# EAGLE design usbspk (EAGLE 6.1)
Test
DOC_ID: CLK-SCH-50; DOC_PART_NO: CLK-PC-03-AUD; DOC_REV: A; DOC_SUBTITLE: EVAL; DOC_TITLE: PCM2704 + TPA2005; PROJECT_NAME: ALARM CLOCK
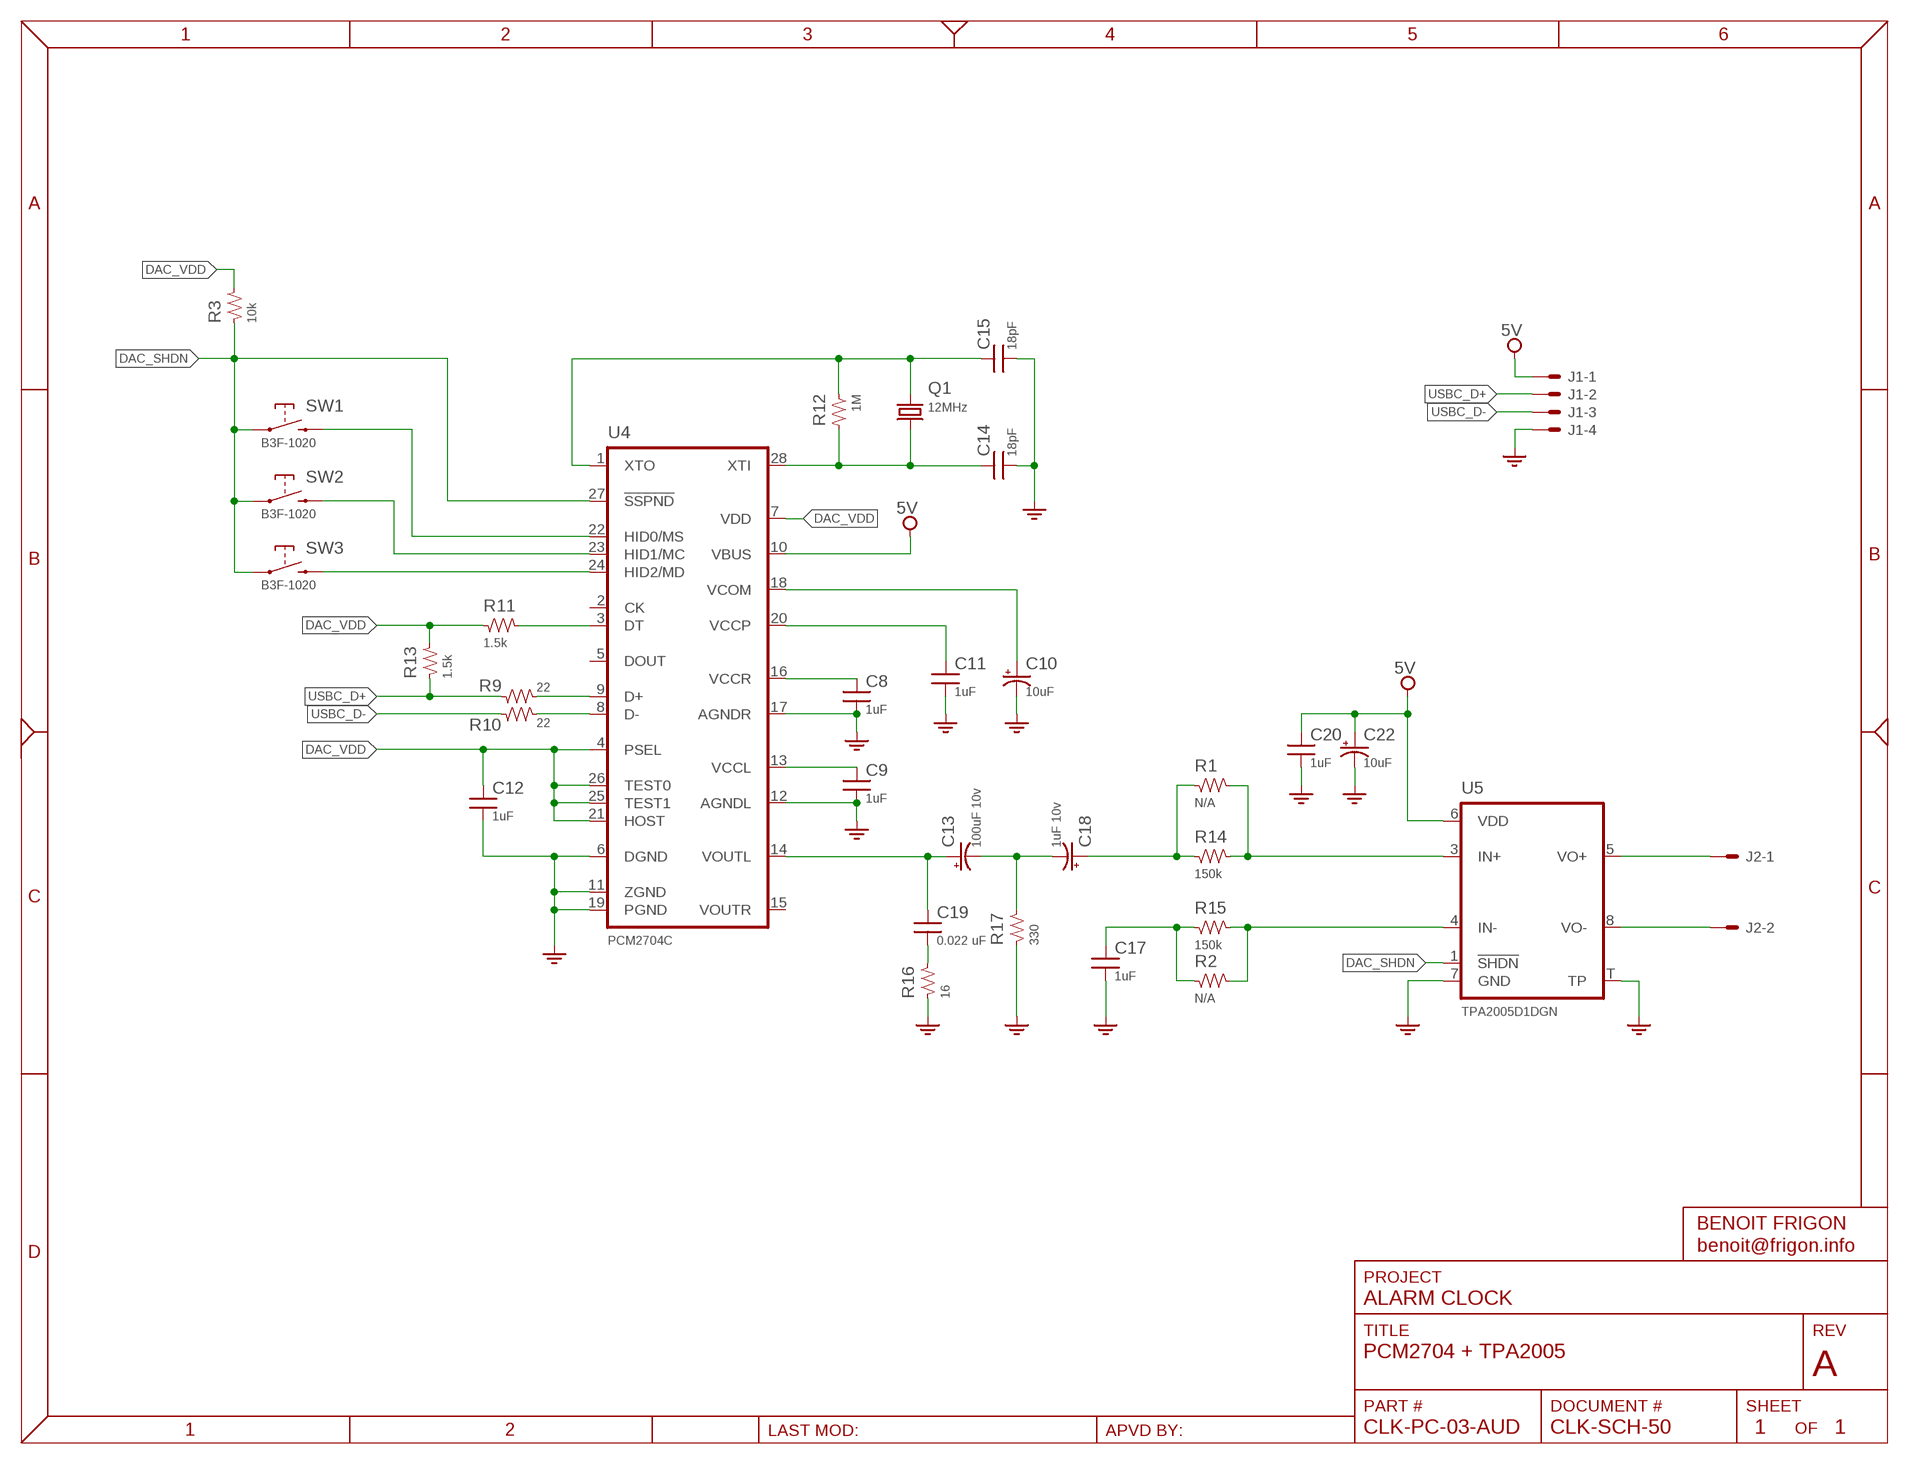
[diagram p0: schematic, sheet 1]
FRAME2 (FRAME_LETTER): SUBTITLE: AUDIO

## Parts
C8  1uF  CAP-0603  [SMD_0603]
C9  1uF  CAP-0603  [SMD_0603]
C10  10uF  CAP-E-S0805  [CAP_S0805]
C11  1uF  CAP-0603  [SMD_0603]
C12  1uF  CAP-0603  [SMD_0603]
C13  100uF 10v  CAP-E-S1210  [CAP_S1210]
C14  18pF  CAP-0603  [SMD_0603]
C15  18pF  CAP-0603  [SMD_0603]
C17  1uF  CAP-0603  [SMD_0603]
C18  1uF 10v  CAP-E-S0805  [CAP_S0805]
C19  0.022 uF  CAP-0603  [SMD_0603]
C20  1uF  CAP-0603  [SMD_0603]
C22  10uF  CAP-E-S0805  [CAP_S0805]
J1  SNG-100-HEADER-04-HDR-V  [HDR_M_4]
J2  SNG-100-HEADER-02-FL-V  [22-23-2021]
Q1  12MHz  XTALHC49S  [HC49/S]
R1  N/A  RES-0603  [SMD_0603]
R2  N/A  RES-0603  [SMD_0603]
R3  10k  RES-0603  [SMD_0603]
R9  22  RES-0603  [SMD_0603]
R10  22  RES-0603  [SMD_0603]
R11  1.5k  RES-0603  [SMD_0603]
R12  1M  RES-0603  [SMD_0603]
R13  1.5k  RES-0603  [SMD_0603]
R14  150k  RES-0603  [SMD_0603]
R15  150k  RES-0603  [SMD_0603]
R16  16  RES-0603  [SMD_0603]
R17  330  RES-0603  [SMD_0603]
SW1  B3F-1020  [B3F-10XX]
SW2  B3F-1020  [B3F-10XX]
SW3  B3F-1020  [B3F-10XX]
U4  PCM2704C  [TSSOP28]
U5  TPA2005D1DGN  [PPSOP8]

## Nets
5V: C20.1 C22.+ J1.1 U4.10(VBUS) U5.6(VDD)
DAC_SHDN: R3.1 SW1.3 SW1.4 SW2.3 SW2.4 SW3.3 SW3.4 U4.27(!SSPND) U5.1(!SHDN)
DAC_VDD: C12.1 R3.2 R11.1 R13.2 U4.4(PSEL) U4.7(VDD) U4.21(HOST) U4.25(TEST1) U4.26(TEST0)
GND: C8.2 C9.2 C10.- C11.2 C12.2 C14.2 C15.2 C17.2 C20.2 C22.- J1.4 R16.1 R17.1 U4.6(DGND) U4.11(ZGND) U4.12(AGNDL) U4.17(AGNDR) U4.19(PGND) U5.7(GND) U5.T(TP)
N$12: R9.2 U4.9(D+)
N$13: R10.2 U4.8(D-)
N$14: C9.1 U4.13(VCCL)
N$15: C10.+ U4.18(VCOM)
N$16: C11.1 U4.20(VCCP)
N$17: C8.1 U4.16(VCCR)
N$18: C18.+ R1.1 R14.1
N$19: R11.2 U4.3(DT)
N$20: SW1.1 SW1.2 U4.22(HID0/MS)
N$21: SW2.1 SW2.2 U4.23(HID1/MC)
N$22: SW3.1 SW3.2 U4.24(HID2/MD)
N$23: C13.+ C19.1 U4.14(VOUTL)
N$24: J2.1 U5.5(VO+)
N$25: J2.2 U5.8(VO-)
N$26: R1.2 R14.2 U5.3(IN+)
N$27: R2.2 R15.2 U5.4(IN-)
N$28: C17.1 R2.1 R15.1
N$30: C13.- C18.- R17.2
N$31: C19.2 R16.2
USBC_D+: J1.2 R9.1 R13.1
USBC_D-: J1.3 R10.1
XTI: C14.1 Q1.2 R12.2 U4.28(XTI)
XTO: C15.1 Q1.1 R12.1 U4.1(XTO)
Unconnected: U4.2(CK) U4.5(DOUT) U4.15(VOUTR)

## Library data of the parts
C8 C9 C11 C12 C14 C15 C17 C19 C20 = Passive:CAP: Capacitor; DESCRIPTION: {DESCRIPTION} - SMT 0603 - {value}; PACKAGE: SMT 0603
C10 C18 C22 = Passive:CAP-E: Electrolytic capacitor; DESCRIPTION: {DESCRIPTION} - SMT 0805 - {VALUE}
C13 = Passive:CAP-E: Electrolytic capacitor; DESCRIPTION: {DESCRIPTION} - SMT 1210 - {VALUE}
J1 = Connectors:SNG-100-HEADER-04: 4 Pos - Single Row - 2.54mm header
J2 = Connectors:SNG-100-HEADER-02: 2 Pos - Single Row - 2.54mm header; DESCRIPTION: {DESCRIPTION} - Vertical; MFG: Molex; SKU: 22-23-2021
Q1 = Crystal:XTAL: Crystal; MFG: TXC; PART_NO: 9C-12.000MEEJ-T
R1-R3 R9-R17 = Passive:RES: Resistor; DESCRIPTION: {DESCRIPTION} - SMT 0603 - {VALUE}; PACKAGE: SMT 0603
SW1-SW3 = Switch:B3F-?: Tactile switch; DESCRIPTION: {DESCRIPTION} - 6x6mm - 5mm Pitch - 100g; MFG: Omron Electronics
U4 = IC:PCM2704C
U5 = IC:TPA2005D1?

## Board
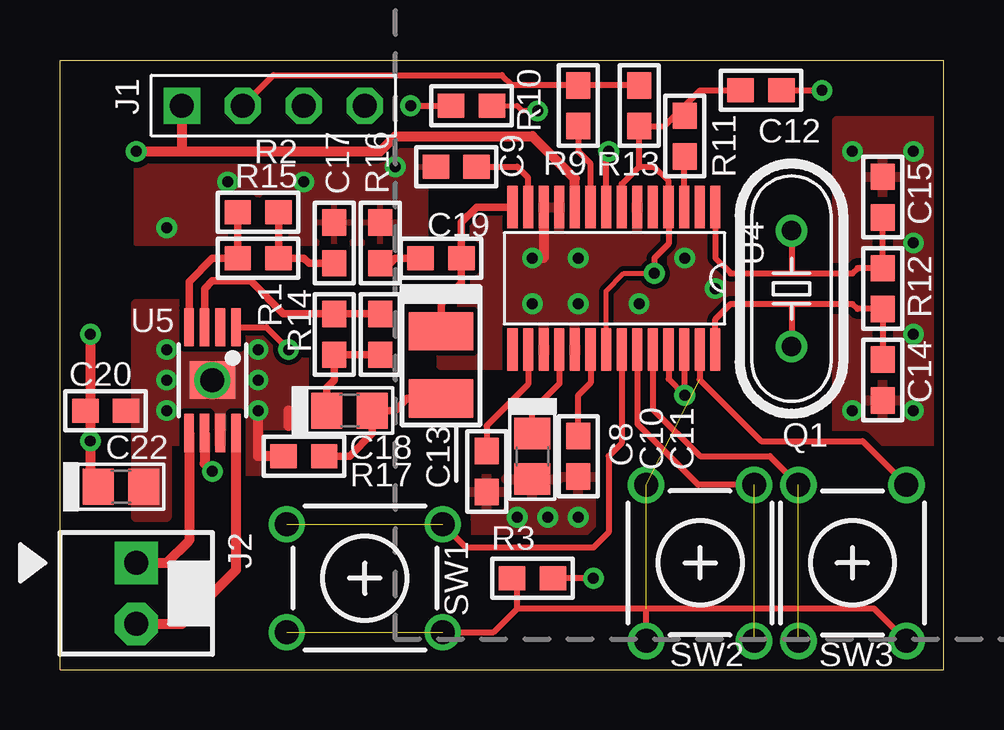
[diagram p1: board, top side]
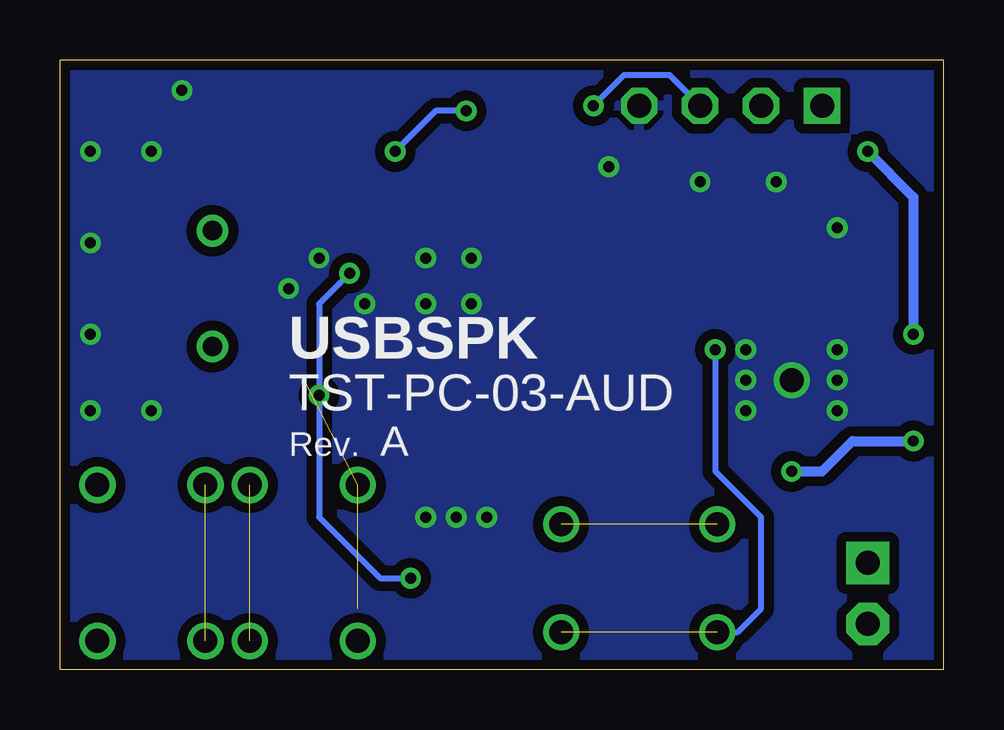
[diagram p2: board, bottom side, seen from below]

Size 36.83 x 25.4 mm. Coordinates in mm from the lower left corner, seen from the top.
Outline: 0,0 36.83,0 36.83,25.4 0,25.4 0,0
Copper layers (1*16): Top 0.035mm / dielectric 1.5mm / Bottom 0.035mm
Design rules: minimum track width 8mil, minimum drill 18mil, track to track 8mil, track to pad 8mil, pad to pad 8mil, via to via 8mil, smd to smd 8mil, copper to edge 16mil, drill to drill 8mil, minimum pad ring 10mil, minimum via ring 8mil, stop-mask expansion 4mil, vias tented up to drill 24mil, thermal gap 10mil

### Footprints (pad centres in the part's own frame; a part is rotated, then mirrored left to right if it is on the bottom)
SMD_0603 = smd 1.1 x 1: 1 -0.85,0; 2 0.85,0
CAP_S0805 = smd 1.3 x 1.5: + -0.95,0; - 0.95,0
CAP_S1210 = smd 1.6 x 2.7: + -1.4,0; - 1.4,0
HDR_M_4 = drill 1 square: 1 0,0 | drill 1 octagon: 2 2.54,0; 3 5.08,0; 4 7.62,0
22-23-2021 = drill 1 pad 1.778 square: 1 -1.27,0 | drill 1 pad 1.778 octagon: 2 1.27,0
HC49/S = drill 0.813: 1 -2.413,0; 2 2.413,0
B3F-10XX = drill 1: 1 3.25,-2.25; 2 -3.25,-2.25; 3 3.25,2.25; 4 -3.25,2.25
TSSOP28 = smd 0.42 x 1.78: 1 0,-5.94; 2 0.65,-5.94; 3 1.3,-5.94; 4 1.95,-5.94; 5 2.6,-5.94; 6 3.25,-5.94; 7 3.9,-5.94; 8 4.55,-5.94; 9 5.2,-5.94; 10 5.85,-5.94; 11 6.5,-5.94; 12 7.15,-5.94; 13 7.8,-5.94; 14 8.45,-5.94; 15 8.45,0; 16 7.8,0; 17 7.15,0; 18 6.5,0; 19 5.85,0; 20 5.2,0; 21 4.55,0; 22 3.9,0; 23 3.25,0; 24 2.6,0; 25 1.95,0; 26 1.3,0; 27 0.65,0; 28 0,0
PPSOP8 = smd 0.4 x 1.6: 1 -0.975,-2.2; 2 -0.325,-2.2; 3 0.325,-2.2; 4 0.975,-2.2; 5 0.975,2.2; 6 0.325,2.2; 7 -0.325,2.2; 8 -0.975,2.2 | smd 1.89 x 1.57: T 0,0

### Placement (x,y rotation side)
C8  17.78,8.26 270 top
C9  16.51,20.95 180 top
C10  19.68,8.89 270 top
C11  21.59,8.89 270 top
C12  29.21,24.13 0 top
C13  15.88,12.7 270 top
C14  34.29,12.06 270 top
C15  34.29,19.68 90 top
C17  11.43,17.78 90 top
C18  12.06,10.79 0 top
C19  15.88,17.14 180 top
C20  1.91,10.79 0 top
C22  2.54,7.62 0 top
J1  5.08,23.5 0 top
J2  3.17,3.17 270 top
Q1  30.48,15.88 270 top
R1  11.43,13.97 90 top
R2  8.26,19.05 180 top
R3  19.68,3.81 0 top
R9  21.59,23.5 270 top
R10  17.14,23.5 0 top
R11  26.04,22.23 270 top
R12  34.29,15.88 270 top
R13  24.13,23.5 270 top
R14  13.34,13.97 90 top
R15  8.26,17.14 180 top
R16  13.34,17.78 270 top
R17  10.16,8.89 0 top
SW1  12.7,3.81 180 top
SW2  26.67,4.45 90 top
SW3  33.02,4.45 270 top
U4  27.3,13.34 180 top
U5  6.35,12.06 180 top
U$1  [INFO_COMPACT]  22.23,11.43 0 bottom

### Tracks (layer width: path | path; a pad name or v marks a point on that pad's centre or on a via)
5V  (via drill 0.46)
  Top 0.406: U4.10 21.45,20.45 19.68,22.23 13.97,22.23 13.34,21.59 5.08,21.59 | U5.6 6.03,8.58 v6.35,8.26 | v1.27,13.97 1.27,10.79 v1.27,9.53 1.27,7.62 | v3.17,21.59 5.08,21.59 | J1.1 5.08,21.59
  Top 0.61: C22.+ 1.27,7.62 | C20.1 1.27,10.79
  Bottom 0.406: v3.17,21.59 1.27,19.68 v1.27,13.97 | v6.35,8.26 5.08,8.26 3.81,9.53 v1.27,9.53
DAC_SHDN  (via drill 0.46)  (3 unrouted)
  Top 0.254: U5.1 8.6,14.27 v9.53,13.34 | U4.27 26.66,12.08 29.21,9.53 33.44,9.53 SW3.4 | SW3.3 33.92,2.54 24.42,2.54 | 24.42,2.54 19.05,2.54 | 19.05,2.54 18.07,1.56 SW1.4 | SW2.4 24.42,2.54 | 19.05,2.54 19.05,3.81 R3.1
  Bottom 0.254: v9.53,13.34 9.53,8.26 7.62,6.35 7.62,2.54 8.6,1.56 SW1.3
DAC_VDD  (via drill 0.46)
  Top 0.203: U4.21 22.75,15.77 23.5,16.51 v24.77,16.51
  Top 0.254: U4.7 23.41,20.23 24.13,20.95 | 24.13,20.95 24.77,20.95 25.36,20.36 U4.4 25.36,17.73 24.77,17.14 v24.77,16.51 | U4.25 25.36,12.11 26,11.46 | U4.26 26,11.46 | 26,11.46 v26.04,11.43 | 24.13,20.95 R13.2 25.18,22.64 25.61,23.07 R11.1 26.04,23.5 26.67,24.13 C12.1 | v22.23,3.81 R3.2
  Bottom 0.254: v24.77,16.51 26.04,15.24 v26.04,11.43 26.04,6.35 23.5,3.81 v22.23,3.81
GND  (via drill 0.46, 1)
  Top 0.254: C12.2 v31.75,24.13
  Top 0.406: U4.12 20.16,17.14 v19.68,17.14 | 9.53,10.16 9.53,10.79 | R17.1 8.26,8.89 v8.26,10.79
  other vias: 19.68,15.24 27.3,15.88 26.04,17.14 24.13,15.24 21.59,17.14 21.59,6.35 19.05,6.35 20.32,6.35 6.99,20.32 10.16,20.32 4.45,12.06 4.45,13.34 4.45,18.41 6.35,12.06 8.26,12.06 8.26,13.34 4.45,10.79 35.56,10.79 35.56,13.97 35.56,17.78 35.56,21.59 33.02,21.59 33.02,10.79 13.97,20.95 21.59,15.24
  pour Bottom (isolate 0.406): 36.83,0 0,0 0,25.4 36.83,25.4
  pour Top: 27.94,19.68 15.88,19.68 15.88,12.7 27.94,12.7
  pour Top (isolate 0.406): 22.23,8.26 17.14,8.26 17.14,5.71 22.23,5.71
  pour Top (isolate 0.203, no thermals): 8.26,10.16 8.26,8.26 7.62,8.26 7.62,9.53 4.45,9.53 4.45,6.35 3.17,6.35 3.17,15.24 10.16,15.24 10.16,10.16
  pour Top (isolate 0.254): 3.17,17.78 15.24,17.78 15.24,21.59 13.97,21.59 13.34,20.95 3.17,20.95
  pour Top (isolate 0.305): 36.83,9.53 32.38,9.53 32.38,22.86 36.83,22.86
N$12
  Top 0.254: U4.9 22.11,21.07 21.59,21.59 R9.2
N$13  (via drill 0.46)
  Top 0.203: v19.9,23.28 19.27,23.28 19.05,23.5 R10.2
  Top 0.254: U4.8 22.75,21.48 v22.86,21.59
  Bottom 0.254: v19.9,23.28 21.17,23.28 v22.86,21.59
N$14
  Top 0.254: C9.1 19.05,20.95 19.5,20.5 U4.13
N$15
  Top 0.254: U4.18 20.8,11.91 19.68,10.79 C10.+
N$16
  Top 0.254: U4.20 22.11,11.95 21.59,11.43 C11.1
N$17
  Top 0.254: U4.16 19.5,11.88 17.78,10.16 C8.1
N$18
  Top 0.254: 11.01,10.79 C18.+
  Top 0.305: C18.+ 11.12,11.75 11.43,12.06 R1.1 R14.1
N$19
  Top 0.254: U4.3 26,21.38 R11.2
N$20  (1 unrouted)
  Top 0.254: U4.22 23.41,9.44 22.86,8.89 22.86,5.71 22.23,5.08 16.93,5.08 SW1.2
N$21  (1 unrouted)
  Top 0.254: U4.23 24.05,10.23 26.59,7.7 SW2.1
N$22  (1 unrouted)
  Top 0.254: U4.24 24.7,10.86 26.67,8.89 29.57,8.89 SW3.2
N$23
  Top 0.305: C13.+ 15.88,15.24 16.73,16.09 C19.1 16.73,18.63 17.37,19.27 U4.14
N$24
  Top 0.406: U5.5 5.38,5.38 4.45,4.45 J2.1
N$25
  Top 0.406: U5.8 7.33,4.15 5.08,1.91 J2.2
N$26
  Top 0.305: U5.3 6.03,15.87 6.35,16.19 7.94,16.19 9.31,14.82 R1.2 R14.2
N$27
  Top 0.305: U5.4 5.38,16.17 6.35,17.14 R15.2 R2.2
N$28
  Top 0.305: C17.1 10.38,16.93 10.16,17.14 R15.1 R2.1
N$30
  Top 0.305: C13.- 14.47,11.3 13.97,10.79 C18.- 13.02,9.84 12.06,8.89 R17.2
N$31
  Top 0.305: R16.2 13.76,16.93 13.97,17.14 C19.2
USBC_D+
  Top 0.254: J1.2 8.89,24.77 18.41,24.77 18.84,24.34 R9.1 R13.1
USBC_D-  (via drill 0.46)
  Top 0.254: v14.61,23.5 R10.1
  Bottom 0.254: J1.3 11.43,24.77 13.34,24.77 v14.61,23.5
XTI
  Top 0.254: U4.28 27.3,14.61 27.94,15.24 30.48,15.24 | 30.48,15.24 Q1.2 | 30.48,15.24 33.02,15.24 33.23,15.03 R12.2 C14.1
XTO
  Top 0.254: U4.1 27.3,17.14 27.94,16.51 30.48,16.51 | Q1.1 30.48,16.51 | 30.48,16.51 33.02,16.51 33.23,16.73 R12.1 C15.1

### Text on the board
_tsilk: J1 | C12 | R2 | C9 | R10 | R15 | R9 | R13 | C17 | R16 | R11 | C19 | U4 | C15 | R12 | U5 | R1 | C14 | R14 | C20 | C10 | C11 | C13 | C8 | C22 | C18 | Q1 | R17 | J2 | SW1 | R3 | SW2 | SW3
_bsilk: USBSPK | TST-PC-03-AUD | A | Rev.